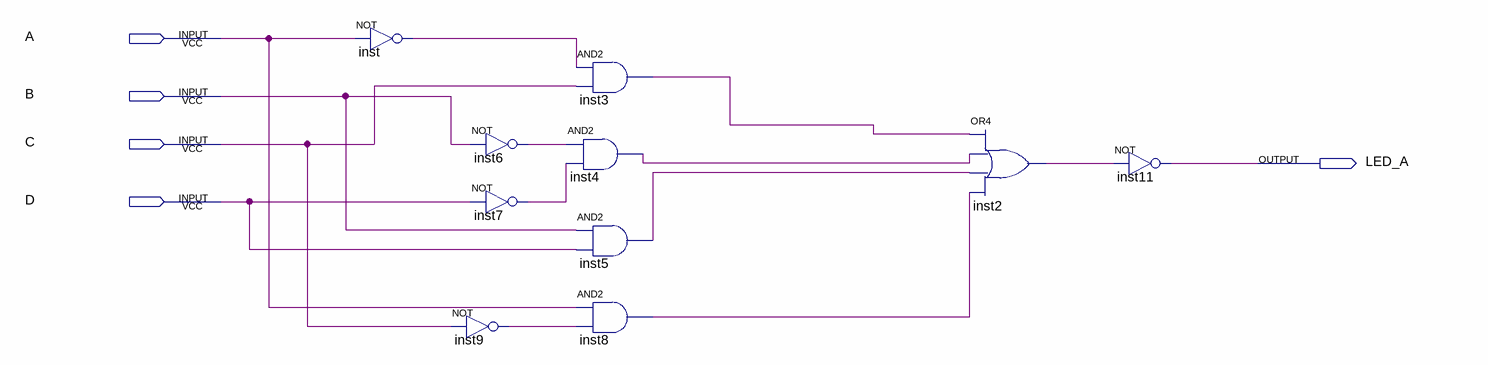
[diagram p0: schematic sheet]
// Quartus schematic led_a.bdf as structural Verilog: 10 symbols, 5 pins
module led_a (
  input  A,
  input  B,
  input  C,
  input  D,
  output LED_A
);

  wire inst2_out, inst3_out, inst4_out, inst5_out, inst6_out, inst7_out, inst8_out, inst9_out, inst_out;

  not inst (inst_out, A);
  not inst6 (inst6_out, B);
  not inst7 (inst7_out, D);
  not inst9 (inst9_out, C);
  and inst3 (inst3_out, inst_out, C);
  and inst4 (inst4_out, inst6_out, inst7_out);
  and inst5 (inst5_out, B, D);
  and inst8 (inst8_out, A, inst9_out);
  or inst2 (inst2_out, inst3_out, inst4_out, inst5_out, inst8_out);
  not inst11 (LED_A, inst2_out);
endmodule
